# Altium project power.PrjPcb (part 1 of 3)
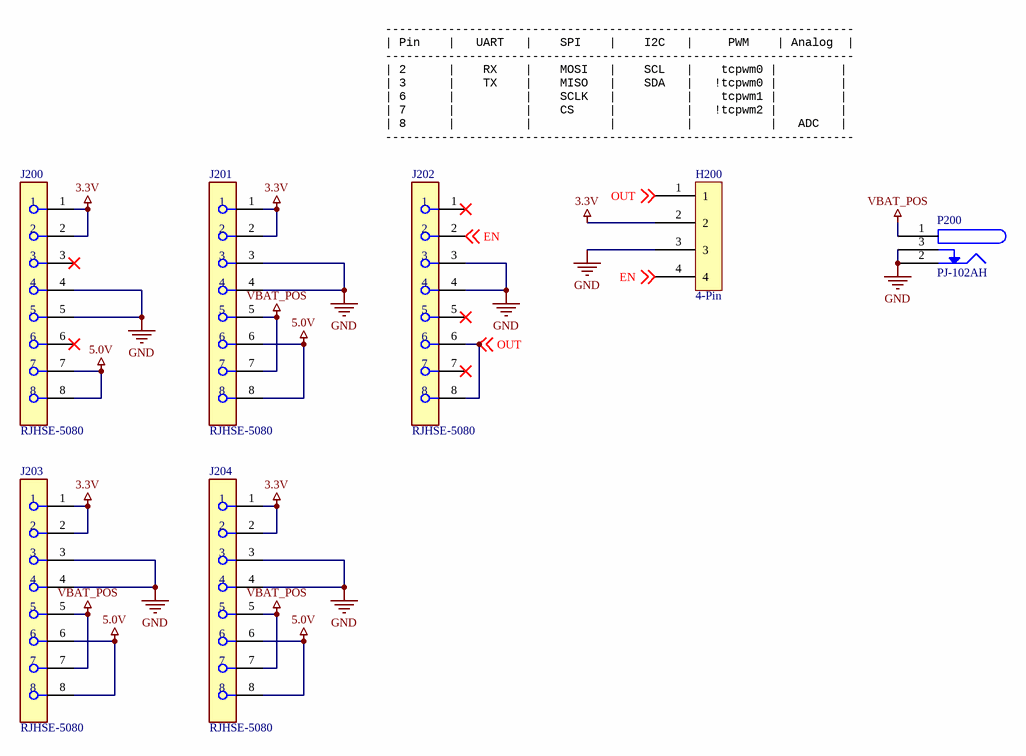
[diagram p0: 02_Connectors.SchDoc]
3 sheets, 57 parts. Net scope: global (net labels, ports and power ports of the same name join across sheets).
Board file: power.PcbDoc
Sheets:
  02_Connectors.SchDoc
  03_ICs.SchDoc
  04_Mechanical.SchDoc

## Sheet 02_Connectors.SchDoc: Off Board Connectors
size A; Revision: A; SheetNumber: 2; SheetTotal: 4; ECE315_Project_Name: ECE453 F23 Base Project

### Parts
H200  4-Pin  [4X1HDR]
J200  RJHSE-5080  [FP-RJHSE-5080-MFG]
J201  RJHSE-5080  [FP-RJHSE-5080-MFG]
J202  RJHSE-5080  [FP-RJHSE-5080-MFG]
J203  RJHSE-5080  [FP-RJHSE-5080-MFG]
J204  RJHSE-5080  [FP-RJHSE-5080-MFG]
P200  Manufacturer Part Number: PJ-102AH  [PJ-102]  (hidden comment: PJ-102)

### Nets
3.3V: H200.2 J200.1 J200.2 J201.1 J201.2 J203.1 J203.2 J204.1 J204.2
5.0V: J200.7 J200.8 J201.6 J201.8 J203.6 J203.8 J204.6 J204.8
GND: H200.3 J200.4 J200.5 J201.3 J201.4 J202.3 J202.4 J203.3 J203.4 J204.3 J204.4 P200.2 P200.3
VBAT_POS: J201.5 J201.7 J203.5 J203.7 J204.5 J204.7 P200.1
EN: H200.4 J202.2 ; off-sheet EN
OUT: H200.1 J202.6 J202.8 ; off-sheet OUT

Not connected (* = marked no-connect by the designer): J200 3* 6*; J202 1* 5* 7*

### Notes on the sheet
- -------------------------------------------------------------------
  | Pin    |   UART   |    SPI    |    I2C   |     PWM    | Analog  |
  -------------------------------------------------------------------
  | 2      |    RX    |    MOSI   |    SCL   |    tcpwm0 |         |
  | 3      |    TX    |    MISO   |    SDA   |   !tcpwm0 |         |
  | 6      |          |    SCLK   |          |    tcpwm1 |         |
  | 7      |          |    CS     |          |   !tcpwm2 |         |
  | 8      |          |           |          |           |   ADC   |
  -------------------------------------------------------------------
- Title:
- Size:
- A
- Project
- Rev:
- Sheet:
- of
- College of Engineering
- 1415 Engineering Drive
- Madison, WI 53706

### Library data of the parts
H200 = 4-Pin: Conn Unshrouded Header HDR 4 POS 2.54mm Solder ST Thru-Hole Bag; Manufacturer: Adam Equipment; Manufacturer Part Number: PH1-04-UA; Number of Positions: 4; Value: 4P-Header; Supplier 1: Digi-Key; Supplier Part Number 1: 2057-PH1-04-UA-ND; RoHS: Yes; Category: Connectors; Stock 1: 21149; Pricing 1: 1=0.1, 10=0.067, 100=0.0498, 500=0.0412, 1000=0.03606, 5000=0.03091, 10000=0.03005 (USD); Termination: Through Hole; Pitch: 2.54mm; Lead Free: Lead Free; ComponentLink1URL: http://www.adam-tech.com/catalog/2010/page_292-295.pdf?src-supplier=Future+Electronics; ComponentLink1Description: http://www.adam-tech.com/catalog/2010/page_292-295.pdf?src-supplier=Future+Electronics; ComponentLink2URL: https://datasheet.octopart.com/PH1-04-UA-Adam-Tech-datasheet-12339966.pdf?src-supplier=Future+Electronics; ComponentLink2Description: https://datasheet.octopart.com/PH1-04-UA-Adam-Tech-datasheet-12339966.pdf?src-supplier=Future+Electronics
J200-J204 = CMP-02366-000003-1: CONN MOD JACK 8P8C R/A UNSHLD; Manufacturer: Amphenol; Current Rating: 1.5A; Voltage Rating: 125V; Pitch: 1.02mm; Conn Orientation: Right Angle; Number Of Contacts: 8; Is Female: yes; Conn Gender: Female; Contact Resistance: 20mR; Number of Ports: 1; Connector Type: RJ45; Lead Free: Yes; Device Class L3: unset; Footprint Url: https://cdn.amphenol-icc.com/media/wysiwyg/files/drawing/rjhse5080.pdf?__cf_chl_jschl_tk__=e349db0bbbb6188a39347cd5e541b92fa02c9719-1587748343-0-AW7tChdeHzRPLX9gSWj7WrKaXQoY9BsmT9Ek0h-T62M9y3Rs9iypFcOtkzb-6sGYQEjFE-jcoNciDETCOZrh1rYyOesac5SvYLoLwHIsHvF4AKBlx-MXmfZUVk9OTTJLqyQq2qMm0PFRLJpNcK0nrKResqOniRSYixG2sPTmOPraH-ULJFBDL602CHqcI9KKBgTq90Jh1OL2Td4moJ99rFsJRJ1Tk_uoxGe8ublcP_ARu-uLpWcQrBcwOcHDTAwL29DAwVaqcH7ta8Ks7WMlHmVl_pILeEDwT0bE9vu5Pa5S3PtNRF1leuFkgi_FMbUxTDulc5xzbXSfng8srUIV1lWXny5nx1fZJEUa_w97yKjffzBMxiWLWVN-V7-uqAaPbyv_m-wRyw5O25OZNyJOeGU; ComponentLink2URL: https://cdn.amphenol-icc.com/media/wysiwyg/files/documentation/datasheet/inputoutput/io-modjack-rjhse.pdf; Device Class L1: Connectors; Package: CONN_MOD_JACK; Mouser Description: Modular Connectors / Ethernet Connectors R/A RJ45 NONSHIELDED 8 CONT NO LEDS; Manufacturer Part Number: RJHSE-5080; Octopart: https://octopart.com/rjhse-5080-amphenol-45060; Category: Conn; Height: 0.535inch; Temperature: -55°C to +85°C; Digikey Description: CONN MOD JACK 8P8C R/A UNSHLD; Device Class L2: Modular / Ethernet Connectors; Contact Material: Gold,Nickel; ComponentLink2Description: Datasheet; Temperature Range Low: -55°C; RoHS: TRUE; Automotive: No; Temperature Range High: +85°C; Supplier: Newark; Supplier Part Number: 28T0105; Stock: 8640; Pricing: 1=0.966, 10=0.854, 25=0.808, 50=0.777, 100=0.748, 250=0.688, 500=0.627, 1000=0.568 (USD); Mounting Technology: Through Hole,Panel; Contact Plating: Gold; Max Current Rating: 1.5A; Number of Positions Loaded: 8; Max Voltage Rating (AC): 125V; Orientation: Right Angle; Packaging: Rail/Tube; Gender: Female; Termination: Solder; Number of Positions: 8; Voltage Rating (DC): 125V; Length: 15.75mm; Depth: 14.99mm; Radiation Hardening: No; RoHS Compliant: Yes; Reach SVHC Compliant: Unknown; ComponentLink1URL: https://datasheet.ciiva.com/7629/1682821-7629402.pdf?src-supplier=Element14; ComponentLink1Description: https://datasheet.ciiva.com/7629/1682821-7629402.pdf?src-supplier=Element14; ComponentLink3URL: https://datasheet.ciiva.com/685/rjhse5080-685586.pdf?src-supplier=Digi-Key; ComponentLink3Description: https://datasheet.ciiva.com/685/rjhse5080-685586.pdf?src-supplier=Digi-Key; ComponentLink4URL: https://datasheet.ciiva.com/1432/1693748-1432448.pdf?src-supplier=Element14; ComponentLink4Description: https://datasheet.ciiva.com/1432/1693748-1432448.pdf?src-supplier=Element14; ComponentLink5URL: https://datasheet.ciiva.com/15171/getdatasheetpartid-643190-15171163.pdf?src-supplier=Verical; ComponentLink5Description: https://datasheet.ciiva.com/15171/getdatasheetpartid-643190-15171163.pdf?src-supplier=Verical
P200 = CONN JACK PWR W/SW: CONN PWR JACK 2.1X5.5MM HIGH CUR; Manufacturer: CUI Inc; Internal Switch(s): Single Switch, Normally Closed; Number of Positions/Contacts: 2 Conductors, 3 Contacts; Plug/Mating Plug Diameter: 2.1mm ID, 5.5mm OD; Gender: Male; Shielding: Unshielded; Voltage - Rated: 24VDC; Current Rating: 5A; Value: CP-102AD; Mounting Type: Through Hole, Right Angle; Supplier: Digi-Key; Connector Type: Jack; Supplier Part Number: CP-102AH-ND; Termination: Solder; Contact Material: Copper; Housing Material: Thermoplastic; Contact Material - Plating: Nickel; Housing Color: Black; Operating Temperature: -25°C ~ 85°C; Color: Black

## Sheet 03_ICs.SchDoc: ICs
size A; Revision: A; SheetNumber: 3; SheetTotal: 4; ECE315_Project_Name: ECE453 F23 Base Project
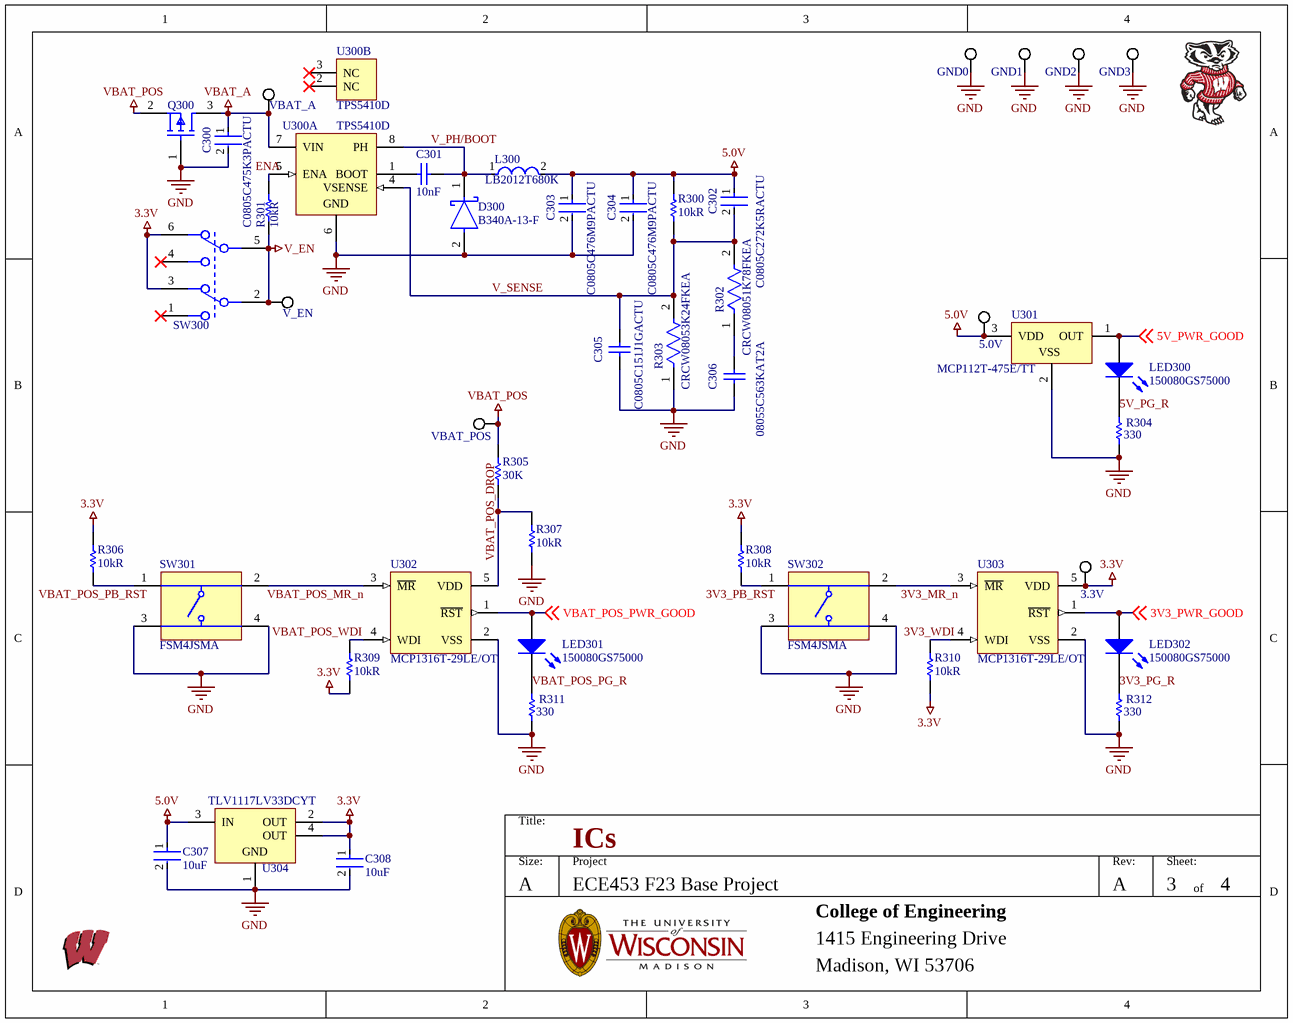
[diagram p1: 03_ICs.SchDoc]

### Parts
3.3V  5019  [KSTN-5019_V]  (value not drawn)
5.0V  5019  [KSTN-5019_V]  (value not drawn)
C300  C0805C475K3PACTU  [FP-C0805C475K3PACTU-MFG]
C301  10nF  [CAP_0805]
C302  C0805C272K5RACTU  [FP-C0805C-DN-MFG]
C303  C0805C476M9PACTU  [FP-C0805C476M9PACTU-MFG]
C304  C0805C476M9PACTU  [FP-C0805C476M9PACTU-MFG]
C305  C0805C151J1GACTU  [CAPC2013X88X50NL20T25]
C306  08055C563KAT2A  [CAPC2013X94X50NL20T25]
C307  value 10uF  [FP-C0805C-DG-MFG]  (hidden comment: C0805C106K8PACTU)
C308  value 10uF  [FP-C0805C-DG-MFG]  (hidden comment: C0805C106K8PACTU)
D300  B340A-13-F  [FP-SMA-MFG]
GND0  5019  [KSTN-5019_V]  (value not drawn)
GND1  5019  [KSTN-5019_V]  (value not drawn)
GND2  5019  [KSTN-5019_V]  (value not drawn)
GND3  5019  [KSTN-5019_V]  (value not drawn)
L300  LB2012T680K  [FP-LB2012-1_25-0_2-IPC_A]
LED300  150080GS75000  [0805_A]
LED301  150080GS75000  [0805_A]
LED302  150080GS75000  [0805_A]
Q300  SSM3J328R,LF  [SOT-23_M]  (value not drawn)
R300  Resistance: 10kR  [RESC2013X60X35NL10T20]  (hidden comment: RC0805FR-0710KL)
R301  Resistance: 10kR  [RESC2013X60X35NL10T20]  (hidden comment: RC0805FR-0710KL)
R302  CRCW08051K78FKEA  [FP-CRCW0805-e3-IPC_C]
R303  CRCW08053K24FKEA  [FP-CRCW0805-e3-IPC_C]
R304  Resistance: 330  [RESC2013X60X35LL10T20]  (hidden comment: RC0805FR-07330RL)
R305  30K  [RES_0805]
R306  Resistance: 10kR  [RESC2013X60X35NL10T20]  (hidden comment: RC0805FR-0710KL)
R307  Resistance: 10kR  [RESC2013X60X35NL10T20]  (hidden comment: RC0805FR-0710KL)
R308  Resistance: 10kR  [RESC2013X60X35NL10T20]  (hidden comment: RC0805FR-0710KL)
R309  Resistance: 10kR  [RESC2013X60X35NL10T20]  (hidden comment: RC0805FR-0710KL)
R310  Resistance: 10kR  [RESC2013X60X35NL10T20]  (hidden comment: RC0805FR-0710KL)
R311  Resistance: 330  [RESC2013X60X35LL10T20]  (hidden comment: RC0805FR-07330RL)
R312  Resistance: 330  [RESC2013X60X35LL10T20]  (hidden comment: RC0805FR-07330RL)
SW300  JS202011SCQN  [C&K_Components_0_MFG]  (value not drawn)
SW301  FSM4JSMA  [TECO-FSM4JSMA_V]
SW302  FSM4JSMA  [TECO-FSM4JSMA_V]
U300  TPS5410D  [D0008A_N]  (parts A,B of 2)
U301  MCP112T-475E/TT  [SOT-23-TT3_L]
U302  MCP1316T-29LE/OT  [SOT-23-OT5_M]
U303  MCP1316T-29LE/OT  [SOT-23-OT5_M]
U304  TLV1117LV33DCYT  [DCY0004A_M]
V_EN  5019  [KSTN-5019_V]  (value not drawn)
VBAT_A  5019  [KSTN-5019_V]  (value not drawn)
VBAT_POS  5019  [KSTN-5019_V]  (value not drawn)

### Nets
3.3V: 3.3V.1 C308.1 R306.2 R308.2 R309.1 R310.1 SW300.3 SW300.6 U303.5(VDD) U304.2(OUT) U304.4(OUT)
5.0V: 5.0V.1 C302.1 C303.1 C304.1 C307.1 L300.2 R300.1 U301.3(VDD) U304.3(IN)
GND: C300.2 C303.2 C304.2 C305.1 C306.1 C307.2 C308.2 D300.2(A) GND0.1 GND1.1 GND2.1 GND3.1 Q300.1(Gate) R303.1 R304.1 R307.1 R311.1 R312.1 SW301.3 SW301.4 SW302.3 SW302.4 U300.6(GND) U301.2(VSS) U302.2(VSS) U303.2(VSS) U304.1(GND)
V_EN: R301.1 SW300.2 SW300.5 V_EN.1
VBAT_A: C300.1 Q300.3(Drain) U300.7(VIN) VBAT_A.1
VBAT_POS: Q300.2(Source) R305.2 VBAT_POS.1
3V3_MR_n: SW302.2 U303.3(~{MR})
3V3_PB_RST: R308.1 SW302.1
3V3_PG_R: LED302.1(K) R312.2
3V3_PWR_GOOD: LED302.2(A) U303.1(~{RST}) ; off-sheet 3V3_PWR_GOOD
3V3_WDI: R310.2 U303.4(WDI)
5V_PG_R: LED300.1(K) R304.2
5V_PWR_GOOD: LED300.2(A) U301.1(OUT) ; off-sheet 5V_PWR_GOOD
ENA: R301.2 U300.5(ENA)
V_PH/BOOT: C301.2 D300.1(C) L300.1 U300.8(PH)
V_SENSE: C302.2 C305.2 R300.2 R302.2 R303.2 U300.4(VSENSE)
VBAT_POS_DROP: R305.1 R307.2 U302.5(VDD)
VBAT_POS_MR_n: SW301.2 U302.3(~{MR})
VBAT_POS_PB_RST: R306.1 SW301.1
VBAT_POS_PG_R: LED301.1(K) R311.2
VBAT_POS_PWR_GOOD: LED301.2(A) U302.1(~{RST}) ; off-sheet VBAT_POS_PWR_GOOD
VBAT_POS_WDI: R309.2 U302.4(WDI)
NetC301_1: C301.1 U300.1(BOOT)
NetC306_2: C306.2 R302.1

Not connected (* = marked no-connect by the designer): SW300 1* 4*; U300 2(NC)* 3(NC)*

### Notes on the sheet
- Title:
- Size:
- A
- Project
- Rev:
- Sheet:
- of
- College of Engineering
- 1415 Engineering Drive
- Madison, WI 53706